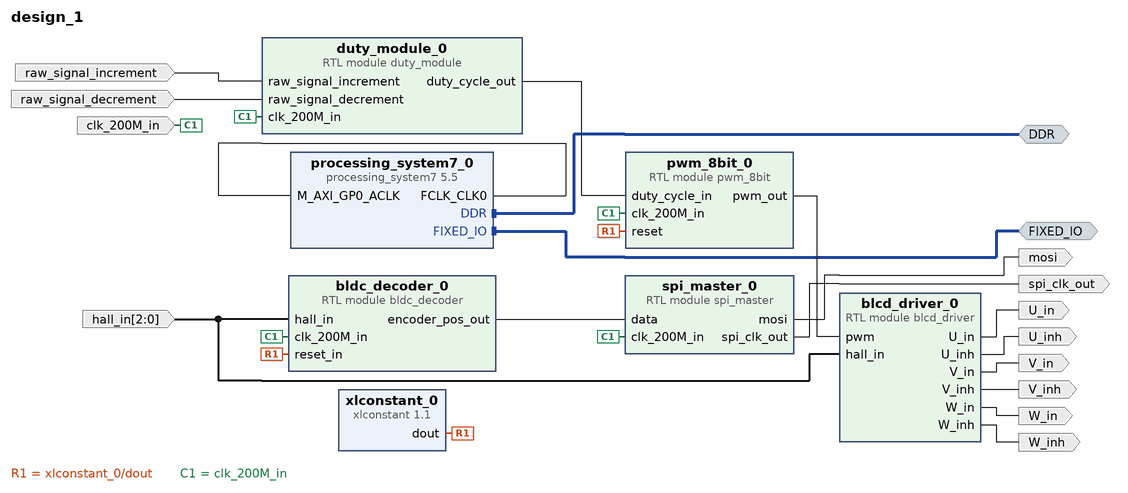
[diagram p0: block diagram of the top level]
# Vivado block design design_1, xc7z010clg225-1, Vivado 2017.2
create_bd_design design_1

create_bd_intf_port -mode Master -vlnv xilinx.com:interface:ddrx_rtl:1.0 DDR
create_bd_intf_port -mode Master -vlnv xilinx.com:display_processing_system7:fixedio_rtl:1.0 FIXED_IO
create_bd_port -dir I raw_signal_increment
create_bd_port -dir I raw_signal_decrement
create_bd_port -dir O U_in
create_bd_port -dir O U_inh
create_bd_port -dir O V_in
create_bd_port -dir O V_inh
create_bd_port -dir O W_in
create_bd_port -dir O W_inh
create_bd_port -dir I -from 2 -to 0 hall_in
create_bd_port -dir O mosi
create_bd_port -dir O spi_clk_out
create_bd_port -dir I clk_200M_in

create_bd_cell -type module -reference bldc_decoder bldc_decoder_0
create_bd_cell -type ip -vlnv xilinx.com:ip:xlconstant:1.1 xlconstant_0
set_property -dict {CONFIG.CONST_VAL 0} [get_bd_cells xlconstant_0]
create_bd_cell -type module -reference pwm_8bit pwm_8bit_0
create_bd_cell -type module -reference blcd_driver blcd_driver_0
create_bd_cell -type ip -vlnv xilinx.com:ip:processing_system7:5.5 processing_system7_0
set_property -dict [list \
  CONFIG.PCW_FCLK_CLK1_BUF TRUE \
  CONFIG.PCW_UIPARAM_DDR_FREQ_MHZ 533.333333 \
  CONFIG.PCW_APU_PERIPHERAL_FREQMHZ 666.666666 \
  CONFIG.PCW_SDIO_PERIPHERAL_FREQMHZ 100 \
  CONFIG.PCW_UART_PERIPHERAL_FREQMHZ 100 \
  CONFIG.PCW_I2C_PERIPHERAL_FREQMHZ 111.111115 \
  CONFIG.PCW_FPGA0_PERIPHERAL_FREQMHZ 50 \
  CONFIG.PCW_FPGA1_PERIPHERAL_FREQMHZ 100 \
  CONFIG.PCW_M_AXI_GP0_FREQMHZ 50 \
  CONFIG.PCW_USE_FABRIC_INTERRUPT 1 \
  CONFIG.PCW_NUM_F2P_INTR_INPUTS 1 \
  CONFIG.PCW_DQ_WIDTH 16 \
  CONFIG.PCW_DQS_WIDTH 2 \
  CONFIG.PCW_DM_WIDTH 2 \
  CONFIG.PCW_MIO_PRIMITIVE 32 \
  CONFIG.PCW_EN_CLK1_PORT 1 \
  CONFIG.PCW_IRQ_F2P_INTR 1 \
  CONFIG.PCW_PERIPHERAL_BOARD_PRESET part0 \
  CONFIG.PCW_PRESET_BANK1_VOLTAGE {LVCMOS 3.3V} \
  CONFIG.PCW_UIPARAM_DDR_MEMORY_TYPE {DDR 3 (Low Voltage)} \
  CONFIG.PCW_UIPARAM_DDR_BUS_WIDTH {16 Bit} \
  CONFIG.PCW_UIPARAM_DDR_PARTNO {MT41J256M16 RE-125} \
  CONFIG.PCW_QSPI_PERIPHERAL_ENABLE 1 \
  CONFIG.PCW_QSPI_QSPI_IO {MIO 1 .. 6} \
  CONFIG.PCW_QSPI_GRP_SINGLE_SS_ENABLE 1 \
  CONFIG.PCW_QSPI_GRP_SINGLE_SS_IO {MIO 1 .. 6} \
  CONFIG.PCW_ENET0_PERIPHERAL_ENABLE 0 \
  CONFIG.PCW_SD0_PERIPHERAL_ENABLE 0 \
  CONFIG.PCW_SD1_PERIPHERAL_ENABLE 1 \
  CONFIG.PCW_SD1_SD1_IO {MIO 10 .. 15} \
  CONFIG.PCW_SD1_GRP_CD_ENABLE 1 \
  CONFIG.PCW_SD1_GRP_CD_IO {MIO 0} \
  CONFIG.PCW_UART1_PERIPHERAL_ENABLE 1 \
  CONFIG.PCW_UART1_UART1_IO {MIO 8 .. 9} \
  CONFIG.PCW_TTC0_PERIPHERAL_ENABLE 1 \
  CONFIG.PCW_TTC0_TTC0_IO EMIO \
  CONFIG.PCW_USB0_PERIPHERAL_ENABLE 1 \
  CONFIG.PCW_USB0_USB0_IO {MIO 28 .. 39} \
  CONFIG.PCW_USB_RESET_ENABLE 1 \
  CONFIG.PCW_USB_RESET_SELECT {Share reset pin} \
  CONFIG.PCW_USB0_RESET_ENABLE 1 \
  CONFIG.PCW_USB0_RESET_IO {MIO 7} \
  CONFIG.PCW_I2C1_PERIPHERAL_ENABLE 1 \
  CONFIG.PCW_I2C1_I2C1_IO {MIO 48 .. 49} \
  CONFIG.PCW_I2C1_GRP_INT_ENABLE 1 \
  CONFIG.PCW_I2C1_GRP_INT_IO EMIO \
  CONFIG.PCW_I2C_RESET_ENABLE 1 \
  CONFIG.PCW_I2C_RESET_SELECT {Share reset pin} \
  CONFIG.PCW_GPIO_MIO_GPIO_ENABLE 1 \
  CONFIG.PCW_GPIO_MIO_GPIO_IO MIO \
  CONFIG.PCW_APU_CLK_RATIO_ENABLE 0.251400462962963 \
  CONFIG.PCW_ENET0_PERIPHERAL_CLKSRC External \
  CONFIG.PCW_UIPARAM_GENERATE_SUMMARY NONE \
  CONFIG.PCW_FPGA_FCLK1_ENABLE 1 \
] [get_bd_cells processing_system7_0]
# 427 more settings of processing_system7_0 are not shown: defaults, MIO pin electricals, DDR timing, and values the tool derives
create_bd_cell -type module -reference spi_master spi_master_0
create_bd_cell -type module -reference duty_module duty_module_0

# ---- connections ----

connect_bd_intf_net [get_bd_intf_ports DDR] [get_bd_intf_pins processing_system7_0/DDR]
connect_bd_intf_net [get_bd_intf_ports FIXED_IO] [get_bd_intf_pins processing_system7_0/FIXED_IO]
connect_bd_net [get_bd_ports raw_signal_increment] [get_bd_pins duty_module_0/raw_signal_increment]
connect_bd_net [get_bd_ports raw_signal_decrement] [get_bd_pins duty_module_0/raw_signal_decrement]
connect_bd_net [get_bd_pins pwm_8bit_0/pwm_out] [get_bd_pins blcd_driver_0/pwm]
connect_bd_net [get_bd_pins blcd_driver_0/U_in] [get_bd_ports U_in]
connect_bd_net [get_bd_pins blcd_driver_0/U_inh] [get_bd_ports U_inh]
connect_bd_net [get_bd_pins blcd_driver_0/V_in] [get_bd_ports V_in]
connect_bd_net [get_bd_pins blcd_driver_0/V_inh] [get_bd_ports V_inh]
connect_bd_net [get_bd_pins blcd_driver_0/W_in] [get_bd_ports W_in]
connect_bd_net [get_bd_pins blcd_driver_0/W_inh] [get_bd_ports W_inh]
connect_bd_net [get_bd_ports hall_in] [get_bd_pins bldc_decoder_0/hall_in] [get_bd_pins blcd_driver_0/hall_in]
connect_bd_net [get_bd_pins bldc_decoder_0/encoder_pos_out] [get_bd_pins spi_master_0/data]
connect_bd_net [get_bd_pins spi_master_0/mosi] [get_bd_ports mosi]
connect_bd_net [get_bd_pins xlconstant_0/dout] [get_bd_pins bldc_decoder_0/reset_in] [get_bd_pins pwm_8bit_0/reset]
connect_bd_net [get_bd_pins duty_module_0/duty_cycle_out] [get_bd_pins pwm_8bit_0/duty_cycle_in]
connect_bd_net [get_bd_pins processing_system7_0/FCLK_CLK0] [get_bd_pins processing_system7_0/M_AXI_GP0_ACLK]
connect_bd_net [get_bd_pins spi_master_0/spi_clk_out] [get_bd_ports spi_clk_out]
connect_bd_net [get_bd_ports clk_200M_in] \
  [get_bd_pins duty_module_0/clk_200M_in] [get_bd_pins pwm_8bit_0/clk_200M_in] [get_bd_pins bldc_decoder_0/clk_200M_in] \
  [get_bd_pins spi_master_0/clk_200M_in]

validate_bd_design
save_bd_design
